# EAGLE schematic ABK-ECS - Rev A3 (EAGLE 7.7.0)

## Sheet 1 of 6: MCU
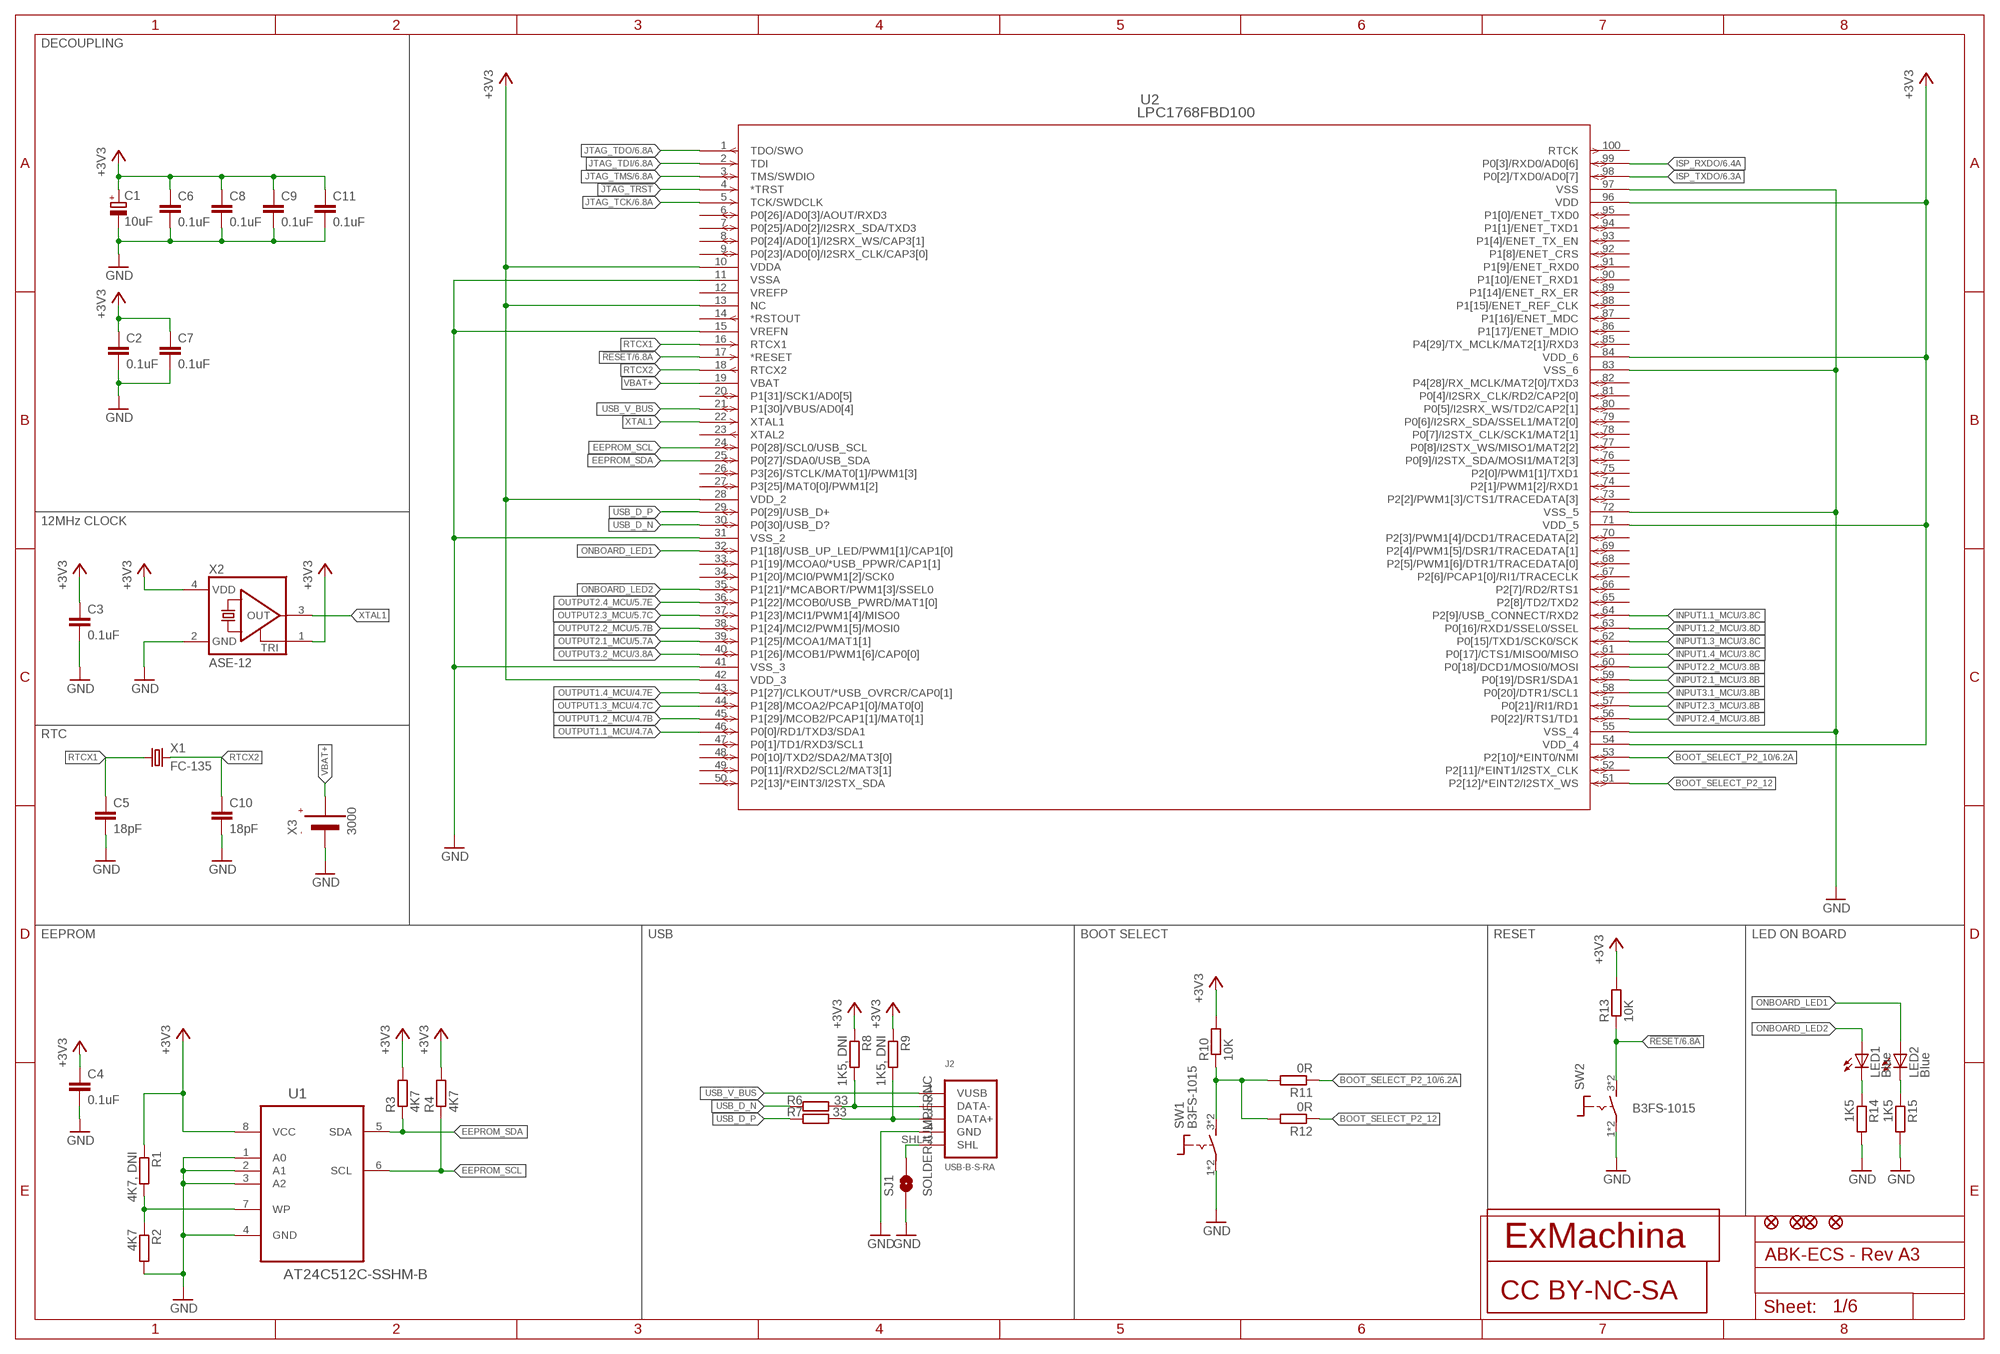
[diagram p0: schematic, sheet 1]

### Parts
C1  10uF  CPOL-EUCT3216  [CT3216]
C2  0.1uF  C-EUC0603  [C0603]
C3  0.1uF  C-EUC0603  [C0603]
C4  0.1uF  C-EUC0603  [C0603]
C5  18pF  C-EUC0603  [C0603]
C6  0.1uF  C-EUC0603  [C0603]
C7  0.1uF  C-EUC0603  [C0603]
C8  0.1uF  C-EUC0603  [C0603]
C9  0.1uF  C-EUC0603  [C0603]
C10  18pF  C-EUC0603  [C0603]
C11  0.1uF  C-EUC0603  [C0603]
CC1  CC-BY-NC-SA  [CC-BY-NC-SA]
J2  USB-B-S-RA  [USB-B-S-RA]
JP1  FIDUCIAL1X2  [FIDUCIAL-1X2]
JP2  FIDUCIAL1X2  [FIDUCIAL-1X2]
JP3  FIDUCIAL1X2  [FIDUCIAL-1X2]
JP4  FIDUCIAL1X2  [FIDUCIAL-1X2]
LED1  Blue  LEDCHIPLED_0603  [CHIPLED_0603]
LED2  Blue  LEDCHIPLED_0603  [CHIPLED_0603]
R1  4K7, DNI  R-EU_R0603  [R0603]
R2  4K7  R-EU_R0603  [R0603]
R3  4K7  R-EU_R0603  [R0603]
R4  4K7  R-EU_R0603  [R0603]
R6  33  R-EU_R0603  [R0603]
R7  33  R-EU_R0603  [R0603]
R8  1K5, DNI  R-EU_R0603  [R0603]
R9  1K5, DNI  R-EU_R0603  [R0603]
R10  10K  R-EU_R0603  [R0603]
R11  0R  R-EU_R0603  [R0603]
R12  0R  R-EU_R0603  [R0603]
R13  10K  R-EU_R0603  [R0603]
R14  1K5  R-EU_R0603  [R0603]
R15  1K5  R-EU_R0603  [R0603]
SJ1  SOLDERJUMPERNC  [SJ_2S]
SW1  B3FS-1015  [B3FS]
SW2  B3FS-1015  [B3FS]
T1  EXMACHINA-LOGO-NAME  [EXM-LOGO-BASELINE]
U1  AT24C512C-SSHM-B  [SOIC127P600X175-8N]
U2  LPC1768FBD100  [SOT407-1]
X1  FC-135  [FC-135]
X2  ASE-12  ASE  [ASE]
X3  3000  [3000]

### Nets
!JTAG_TRST: U2.4(*TRST)
!RESET: R13.1 SW2.3 SW2.4 U2.17(*RESET) ; also sheet 6
+3V3 [supply]: C1.+ C2.1 C3.1 C4.1 C6.1 C7.1 C8.1 C9.1 C11.1 R1.1 R3.2 R4.2 R8.1 R9.1 R10.2 R13.2 U1.8(VCC) U2.10(VDDA) U2.13(NC) U2.28(VDD_2) U2.42(VDD_3) U2.54(VDD_4) U2.71(VDD_5) U2.84(VDD_6) U2.96(VDD) X2.1(TRI) X2.4(VDD) ; also sheet 2,3,6
BOOT_SELECT_P2_10 [signal]: R11.1 U2.53(P2[10]/*EINT0/NMI) ; also sheet 6
BOOT_SELECT_P2_12 [signal]: R12.1 U2.51(P2[12]/*EINT2/I2STX_WS)
EEPROM_SCL: R4.1 U1.6(SCL) U2.24(P0[28]/SCL0/USB_SCL)
EEPROM_SDA: R3.1 U1.5(SDA) U2.25(P0[27]/SDA0/USB_SDA)
GND [supply]: C1.- C2.2 C3.2 C4.2 C5.2 C6.2 C7.2 C8.2 C9.2 C10.2 C11.2 J2.4(GND) R2.2 R14.2 R15.2 SJ1.1 SW1.1 SW1.2 SW2.1 SW2.2 U1.1(A0) U1.2(A1) U1.3(A2) U1.4(GND) U2.11(VSSA) U2.15(VREFN) U2.31(VSS_2) U2.41(VSS_3) U2.55(VSS_4) U2.72(VSS_5) U2.83(VSS_6) U2.97(VSS) X2.2(GND) X3.-(VBAT-) ; also sheet 2,3,4,5,6
INPUT1.1_MCU: U2.64(P2[9]/USB_CONNECT/RXD2) ; also sheet 3
INPUT1.2_MCU: U2.63(P0[16]/RXD1/SSEL0/SSEL) ; also sheet 3
INPUT1.3_MCU: U2.62(P0[15]/TXD1/SCK0/SCK) ; also sheet 3
INPUT1.4_MCU: U2.61(P0[17]/CTS1/MISO0/MISO) ; also sheet 3
INPUT2.1_MCU: U2.59(P0[19]/DSR1/SDA1) ; also sheet 3
INPUT2.2_MCU: U2.60(P0[18]/DCD1/MOSI0/MOSI) ; also sheet 3
INPUT2.3_MCU: U2.57(P0[21]/RI1/RD1) ; also sheet 3
INPUT2.4_MCU: U2.56(P0[22]/RTS1/TD1) ; also sheet 3
INPUT3.1_MCU: U2.58(P0[20]/DTR1/SCL1) ; also sheet 3
ISP_RXDO [signal]: U2.99(P0[3]/RXD0/AD0[6]) ; also sheet 6
ISP_TXDO [signal]: U2.98(P0[2]/TXD0/AD0[7]) ; also sheet 6
JTAG_TCK [signal]: U2.5(TCK/SWDCLK) ; also sheet 6
JTAG_TDI [signal]: U2.2(TDI) ; also sheet 6
JTAG_TDO [signal]: U2.1(TDO/SWO) ; also sheet 6
JTAG_TMS [signal]: U2.3(TMS/SWDIO) ; also sheet 6
N$1 [signal]: J2.3(DATA+) R7.1 R9.2
N$2 [signal]: J2.2(DATA-) R6.1 R8.2
N$3 [signal]: LED2.C R15.1
N$5 [signal]: R10.1 R11.2 R12.2 SW1.3 SW1.4
N$27: R1.2 R2.1 U1.7(WP)
N$29 [signal]: LED1.C R14.1
N$70: J2.SHL J2.SHL1(SHL) SJ1.2
ONBOARD_LED1 [signal]: LED2.A U2.32(P1[18]/USB_UP_LED/PWM1[1]/CAP1[0])
ONBOARD_LED2 [signal]: LED1.A U2.35(P1[21]/*MCABORT/PWM1[3]/SSEL0)
OUTPUT1.1_MCU: U2.46(P0[0]/RD1/TXD3/SDA1) ; also sheet 4
OUTPUT1.2_MCU: U2.45(P1[29]/MCOB2/PCAP1[1]/MAT0[1]) ; also sheet 4
OUTPUT1.3_MCU: U2.44(P1[28]/MCOA2/PCAP1[0]/MAT0[0]) ; also sheet 4
OUTPUT1.4_MCU: U2.43(P1[27]/CLKOUT/*USB_OVRCR/CAP0[1]) ; also sheet 4
OUTPUT2.1_MCU: U2.39(P1[25]/MCOA1/MAT1[1]) ; also sheet 5
OUTPUT2.2_MCU: U2.38(P1[24]/MCI2/PWM1[5]/MOSI0) ; also sheet 5
OUTPUT2.3_MCU: U2.37(P1[23]/MCI1/PWM1[4]/MISO0) ; also sheet 5
OUTPUT2.4_MCU: U2.36(P1[22]/MCOB0/USB_PWRD/MAT1[0]) ; also sheet 5
OUTPUT3.2_MCU: U2.40(P1[26]/MCOB1/PWM1[6]/CAP0[0]) ; also sheet 3,5
RTCX1: C5.1 U2.16(RTCX1) X1.1
RTCX2: C10.1 U2.18(RTCX2) X1.2
USB_D_N [signal]: R6.2 U2.30(P0[30]/USB_D?)
USB_D_P [signal]: R7.2 U2.29(P0[29]/USB_D+)
USB_V_BUS [signal]: J2.1(VUSB) U2.21(P1[30]/VBUS/AD0[4])
VBAT+: U2.19(VBAT) X3.+1(VBAT+) X3.+2(VBAT+)
XTAL1: U2.22(XTAL1) X2.3(OUT)
Unconnected: U2.6(P0[26]/AD0[3]/AOUT/RXD3) U2.7(P0[25]/AD0[2]/I2SRX_SDA/TXD3) U2.8(P0[24]/AD0[1]/I2SRX_WS/CAP3[1]) U2.9(P0[23]/AD0[0]/I2SRX_CLK/CAP3[0]) U2.14(*RSTOUT) U2.20(P1[31]/SCK1/AD0[5]) U2.23(XTAL2) U2.26(P3[26]/STCLK/MAT0[1]/PWM1[3]) U2.27(P3[25]/MAT0[0]/PWM1[2]) U2.33(P1[19]/MCOA0/*USB_PPWR/CAP1[1]) U2.34(P1[20]/MCI0/PWM1[2]/SCK0) U2.47(P0[1]/TD1/RXD3/SCL1) U2.48(P0[10]/TXD2/SDA2/MAT3[0]) U2.49(P0[11]/RXD2/SCL2/MAT3[1]) U2.50(P2[13]/*EINT3/I2STX_SDA) U2.52(P2[11]/*EINT1/I2STX_CLK) U2.65(P2[8]/TD2/TXD2) U2.66(P2[7]/RD2/RTS1) U2.67(P2[6]/PCAP1[0]/RI1/TRACECLK) U2.68(P2[5]/PWM1[6]/DTR1/TRACEDATA[0]) U2.69(P2[4]/PWM1[5]/DSR1/TRACEDATA[1]) U2.70(P2[3]/PWM1[4]/DCD1/TRACEDATA[2]) U2.73(P2[2]/PWM1[3]/CTS1/TRACEDATA[3]) U2.74(P2[1]/PWM1[2]/RXD1) U2.75(P2[0]/PWM1[1]/TXD1) U2.76(P0[9]/I2STX_SDA/MOSI1/MAT2[3]) U2.77(P0[8]/I2STX_WS/MISO1/MAT2[2]) U2.78(P0[7]/I2STX_CLK/SCK1/MAT2[1]) U2.79(P0[6]/I2SRX_SDA/SSEL1/MAT2[0]) U2.80(P0[5]/I2SRX_WS/TD2/CAP2[1]) U2.81(P0[4]/I2SRX_CLK/RD2/CAP2[0]) U2.82(P4[28]/RX_MCLK/MAT2[0]/TXD3) U2.85(P4[29]/TX_MCLK/MAT2[1]/RXD3) U2.86(P1[17]/ENET_MDIO) U2.87(P1[16]/ENET_MDC) U2.88(P1[15]/ENET_REF_CLK) U2.89(P1[14]/ENET_RX_ER) U2.90(P1[10]/ENET_RXD1) U2.91(P1[9]/ENET_RXD0) U2.92(P1[8]/ENET_CRS) U2.93(P1[4]/ENET_TX_EN) U2.94(P1[1]/ENET_TXD1) U2.95(P1[0]/ENET_TXD0) U2.100(RTCK)

### Notes on the sheet
- DECOUPLING
- 12MHz CLOCK
- RTC
- EEPROM | USB | BOOT SELECT | RESET | LED ON BOARD

## Sheet 2 of 6: POWER
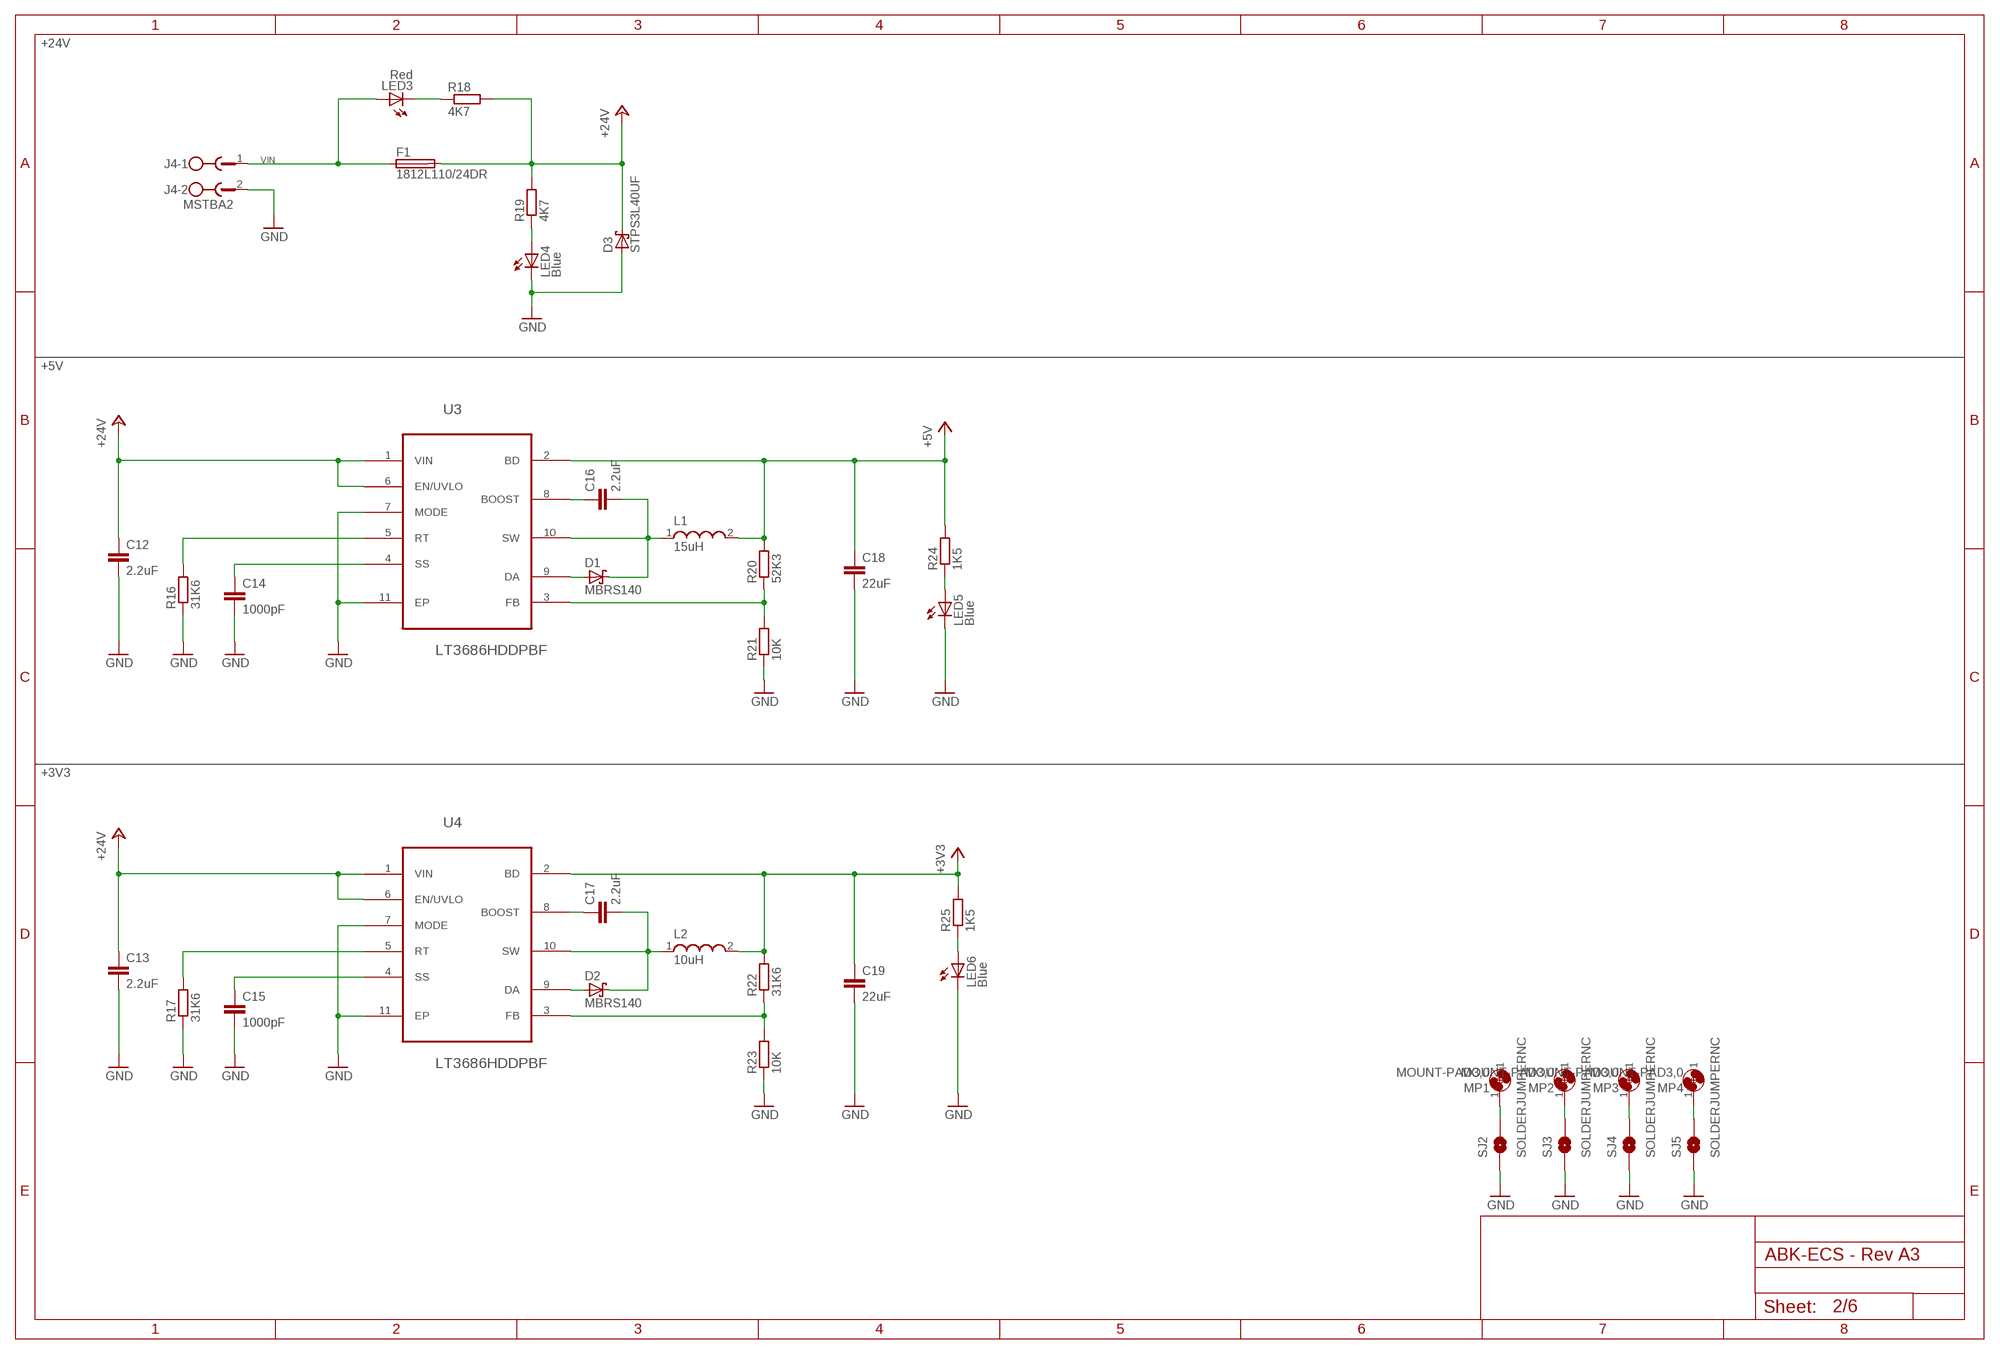
[diagram p1: schematic, sheet 2]

### Parts
C12  2.2uF  C-EUC0603  [C0603]
C13  2.2uF  C-EUC0603  [C0603]
C14  1000pF  C-EUC0603  [C0603]
C15  1000pF  C-EUC0603  [C0603]
C16  2.2uF  C-EUC0603  [C0603]
C17  2.2uF  C-EUC0603  [C0603]
C18  22uF  C-EUC0805  [C0805]
C19  22uF  C-EUC0805  [C0805]
D1  MBRS140  [DO-214AA]
D2  MBRS140  [DO-214AA]
D3  STPS3L40UF  [SMB]
F1  1812L110/24DR  [LITTLEFUSE_SMD]
J4  MSTBA2  [MSTBA2]
L1  15uH  WE-PD2_5848/5820  [WE-PD2_5848/5820]
L2  10uH  WE-PD2_5848/5820  [WE-PD2_5848/5820]
LED3  Red  LEDCHIPLED_0603  [CHIPLED_0603]
LED4  Blue  LEDCHIPLED_0603  [CHIPLED_0603]
LED5  Blue  LEDCHIPLED_0603  [CHIPLED_0603]
LED6  Blue  LEDCHIPLED_0603  [CHIPLED_0603]
MP1  MOUNT-PAD3,0  [P3,0]
MP2  MOUNT-PAD3,0  [P3,0]
MP3  MOUNT-PAD3,0  [P3,0]
MP4  MOUNT-PAD3,0  [P3,0]
R16  31K6  R-EU_R0603  [R0603]
R17  31K6  R-EU_R0603  [R0603]
R18  4K7  R-EU_R0603  [R0603]
R19  4K7  R-EU_R0603  [R0603]
R20  52K3  R-EU_R0603  [R0603]
R21  10K  R-EU_R0603  [R0603]
R22  31K6  R-EU_R0603  [R0603]
R23  10K  R-EU_R0603  [R0603]
R24  1K5  R-EU_R0603  [R0603]
R25  1K5  R-EU_R0603  [R0603]
SJ2  SOLDERJUMPERNC  [SJ_2S]
SJ3  SOLDERJUMPERNC  [SJ_2S]
SJ4  SOLDERJUMPERNC  [SJ_2S]
SJ5  SOLDERJUMPERNC  [SJ_2S]
U3  LT3686HDDPBF  [DFN300X300X80-11N]
U4  LT3686HDDPBF  [DFN300X300X80-11N]

### Nets
1: MP1.1 SJ2.2
2: MP2.1 SJ3.2
3: MP3.1 SJ4.2
4: MP4.1 SJ5.2
+3V3 [supply]: C19.1 L2.2 R22.2 R25.2 U4.2(BD) ; also sheet 1,3,6
+5V [supply]: C18.1 L1.2 R20.2 R24.2 U3.2(BD) ; also sheet 3,4,5
+24V: C12.1 C13.1 D3.C F1.2 R18.2 R19.2 U3.1(VIN) U3.6(EN/UVLO) U4.1(VIN) U4.6(EN/UVLO) ; also sheet 3,4,5
GND [supply]: C12.2 C13.2 C14.2 C15.2 C18.2 C19.2 D3.A J4.2 LED4.C LED5.C LED6.C R16.1 R17.1 R21.1 R23.1 SJ2.1 SJ3.1 SJ4.1 SJ5.1 U3.7(MODE) U3.11(EP) U4.7(MODE) U4.11(EP) ; also sheet 1,3,4,5,6
N$4: R16.2 U3.5(RT)
N$6: C14.1 U3.4(SS)
N$7: R17.2 U4.5(RT)
N$8: C15.1 U4.4(SS)
N$9: R20.1 R21.2 U3.3(FB)
N$10: C16.1 U3.8(BOOST)
N$11: C16.2 D1.C L1.1 U3.10(SW)
N$12: D1.A U3.9(DA)
N$13: R22.1 R23.2 U4.3(FB)
N$14: C17.1 U4.8(BOOST)
N$15: C17.2 D2.C L2.1 U4.10(SW)
N$16: D2.A U4.9(DA)
N$44: LED4.A R19.1
N$45: LED3.C R18.1
N$50: LED6.A R25.1
N$51: LED5.A R24.1
VIN: F1.1 J4.1 LED3.A

### Notes on the sheet
- +24V
- +5V
- +3V3

## Sheet 3 of 6: INPUT
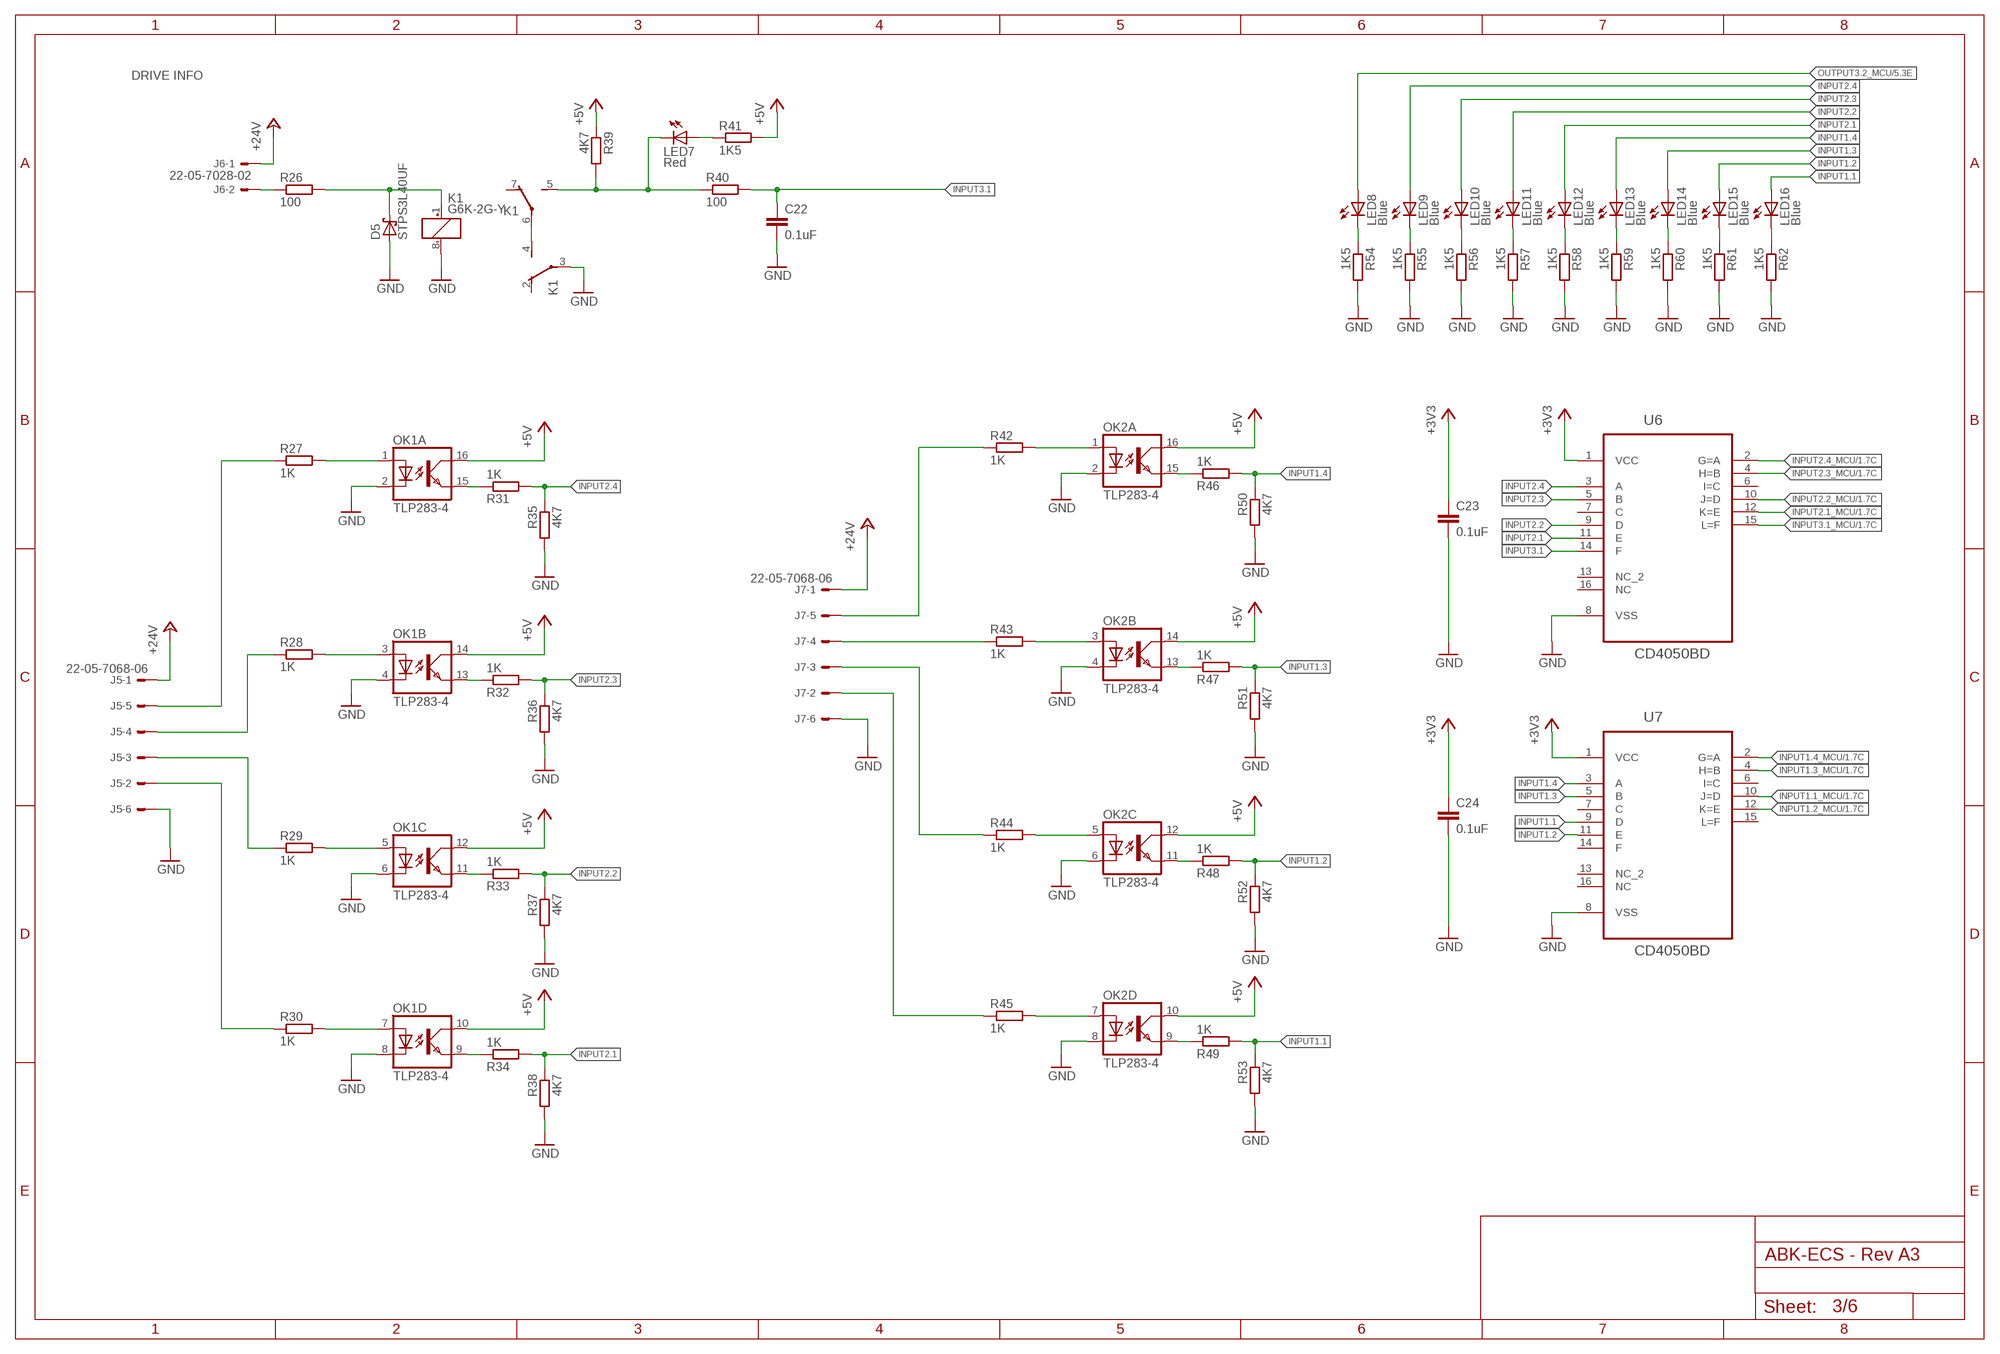
[diagram p2: schematic, sheet 3]

### Parts
C22  0.1uF  C-EUC0603  [C0603]
C23  0.1uF  C-EUC0603  [C0603]
C24  0.1uF  C-EUC0603  [C0603]
D5  STPS3L40UF  [SMB]
J5  22-05-7068-06  [7395-06]
J6  22-05-7028-02  [7395-02]
J7  22-05-7068-06  [7395-06]
K1  G6K-2G-Y  [G6K-2G-Y]
LED7  Red  LEDCHIPLED_0603  [CHIPLED_0603]
LED8  Blue  LEDCHIPLED_0603  [CHIPLED_0603]
LED9  Blue  LEDCHIPLED_0603  [CHIPLED_0603]
LED10  Blue  LEDCHIPLED_0603  [CHIPLED_0603]
LED11  Blue  LEDCHIPLED_0603  [CHIPLED_0603]
LED12  Blue  LEDCHIPLED_0603  [CHIPLED_0603]
LED13  Blue  LEDCHIPLED_0603  [CHIPLED_0603]
LED14  Blue  LEDCHIPLED_0603  [CHIPLED_0603]
LED15  Blue  LEDCHIPLED_0603  [CHIPLED_0603]
LED16  Blue  LEDCHIPLED_0603  [CHIPLED_0603]
OK1  TLP283-4  [MINI-FLAT-16]
OK2  TLP283-4  [MINI-FLAT-16]
R26  100  R-EU_R0603  [R0603]
R27  1K  R-EU_R0603  [R0603]
R28  1K  R-EU_R0603  [R0603]
R29  1K  R-EU_R0603  [R0603]
R30  1K  R-EU_R0603  [R0603]
R31  1K  R-EU_R0603  [R0603]
R32  1K  R-EU_R0603  [R0603]
R33  1K  R-EU_R0603  [R0603]
R34  1K  R-EU_R0603  [R0603]
R35  4K7  R-EU_R0603  [R0603]
R36  4K7  R-EU_R0603  [R0603]
R37  4K7  R-EU_R0603  [R0603]
R38  4K7  R-EU_R0603  [R0603]
R39  4K7  R-EU_R0603  [R0603]
R40  100  R-EU_R0603  [R0603]
R41  1K5  R-EU_R0603  [R0603]
R42  1K  R-EU_R0603  [R0603]
R43  1K  R-EU_R0603  [R0603]
R44  1K  R-EU_R0603  [R0603]
R45  1K  R-EU_R0603  [R0603]
R46  1K  R-EU_R0603  [R0603]
R47  1K  R-EU_R0603  [R0603]
R48  1K  R-EU_R0603  [R0603]
R49  1K  R-EU_R0603  [R0603]
R50  4K7  R-EU_R0603  [R0603]
R51  4K7  R-EU_R0603  [R0603]
R52  4K7  R-EU_R0603  [R0603]
R53  4K7  R-EU_R0603  [R0603]
R54  1K5  R-EU_R0603  [R0603]
R55  1K5  R-EU_R0603  [R0603]
R56  1K5  R-EU_R0603  [R0603]
R57  1K5  R-EU_R0603  [R0603]
R58  1K5  R-EU_R0603  [R0603]
R59  1K5  R-EU_R0603  [R0603]
R60  1K5  R-EU_R0603  [R0603]
R61  1K5  R-EU_R0603  [R0603]
R62  1K5  R-EU_R0603  [R0603]
U6  CD4050BD  [SOIC127P600X175-16N]
U7  CD4050BD  [SOIC127P600X175-16N]

### Nets
+3V3 [supply]: C23.1 C24.1 U6.1(VCC) U7.1(VCC) ; also sheet 1,2,6
+5V [supply]: OK1.10(D:COL) OK1.12(C:COL) OK1.14(B:COL) OK1.16(A:COL) OK2.10(D:COL) OK2.12(C:COL) OK2.14(B:COL) OK2.16(A:COL) R39.1 R41.2 ; also sheet 2,4,5
+24V: J5.1 J6.1 J7.1 ; also sheet 2,4,5
GND [supply]: C22.2 C23.2 C24.2 D5.A J5.6 J7.6 K1.3(2:P) K1.8(1:-) OK1.2(A:C) OK1.4(B:C) OK1.6(C:C) OK1.8(D:C) OK2.2(A:C) OK2.4(B:C) OK2.6(C:C) OK2.8(D:C) R35.2 R36.2 R37.2 R38.2 R50.2 R51.2 R52.2 R53.2 R54.2 R55.2 R56.2 R57.2 R58.2 R59.2 R60.2 R61.2 R62.2 U6.8(VSS) U7.8(VSS) ; also sheet 1,2,4,5,6
INPUT1.1: LED16.A R49.2 R53.1 U7.9(D)
INPUT1.1_MCU: U7.10(J=D) ; also sheet 1
INPUT1.2: LED15.A R48.2 R52.1 U7.11(E)
INPUT1.2_MCU: U7.12(K=E) ; also sheet 1
INPUT1.3: LED14.A R47.2 R51.1 U7.5(B)
INPUT1.3_MCU: U7.4(H=B) ; also sheet 1
INPUT1.4: LED13.A R46.2 R50.1 U7.3(A)
INPUT1.4_MCU: U7.2(G=A) ; also sheet 1
INPUT2.1: LED12.A R34.2 R38.1 U6.11(E)
INPUT2.1_MCU: U6.12(K=E) ; also sheet 1
INPUT2.2: LED11.A R33.2 R37.1 U6.9(D)
INPUT2.2_MCU: U6.10(J=D) ; also sheet 1
INPUT2.3: LED10.A R32.2 R36.1 U6.5(B)
INPUT2.3_MCU: U6.4(H=B) ; also sheet 1
INPUT2.4: LED9.A R31.2 R35.1 U6.3(A)
INPUT2.4_MCU: U6.2(G=A) ; also sheet 1
INPUT3.1: C22.1 R40.2 U6.14(F)
INPUT3.1_MCU: U6.15(L=F) ; also sheet 1
N$28: D5.C K1.1(1:+) R26.2
N$32: J6.2 R26.1
N$41: OK1.1(A:A) R27.2
N$47: OK1.3(B:A) R28.2
N$48: OK1.5(C:A) R29.2
N$49: OK1.7(D:A) R30.2
N$52: J5.2 R30.1
N$53: J5.3 R29.1
N$54: J5.4 R28.1
N$55: J5.5 R27.1
N$56 [signal]: LED8.C R54.1
N$57 [signal]: LED9.C R55.1
N$58 [signal]: LED10.C R56.1
N$59 [signal]: LED11.C R57.1
N$60: K1.4(2:S) K1.6(3:P)
N$61: OK1.9(D:EMIT) R34.1
N$62: OK1.11(C:EMIT) R33.1
N$63: OK1.13(B:EMIT) R32.1
N$64: OK1.15(A:EMIT) R31.1
N$65 [signal]: LED12.C R58.1
N$73: K1.5(3:S) LED7.C R39.2 R40.1
N$74: LED7.A R41.1
N$81: OK2.1(A:A) R42.2
N$82: J7.5 R42.1
N$90 [signal]: LED16.C R62.1
N$100: OK2.15(A:EMIT) R46.1
N$101: OK2.3(B:A) R43.2
N$102: J7.4 R43.1
N$103: OK2.13(B:EMIT) R47.1
N$104: OK2.5(C:A) R44.2
N$105: J7.3 R44.1
N$106: OK2.11(C:EMIT) R48.1
N$107 [signal]: LED13.C R59.1
N$108 [signal]: LED14.C R60.1
N$109 [signal]: LED15.C R61.1
N$110: OK2.9(D:EMIT) R49.1
N$111: OK2.7(D:A) R45.2
N$112: J7.2 R45.1
OUTPUT3.2_MCU: LED8.A ; also sheet 1,5
Unconnected: K1.2(2:O) K1.7(3:O) U6.6(I=C) U6.7(C) U6.13(NC_2) U6.16(NC) U7.6(I=C) U7.7(C) U7.13(NC_2) U7.14(F) U7.15(L=F) U7.16(NC)

### Notes on the sheet
- DRIVE INFO

## Sheet 4 of 6: OUTPUT 1/2
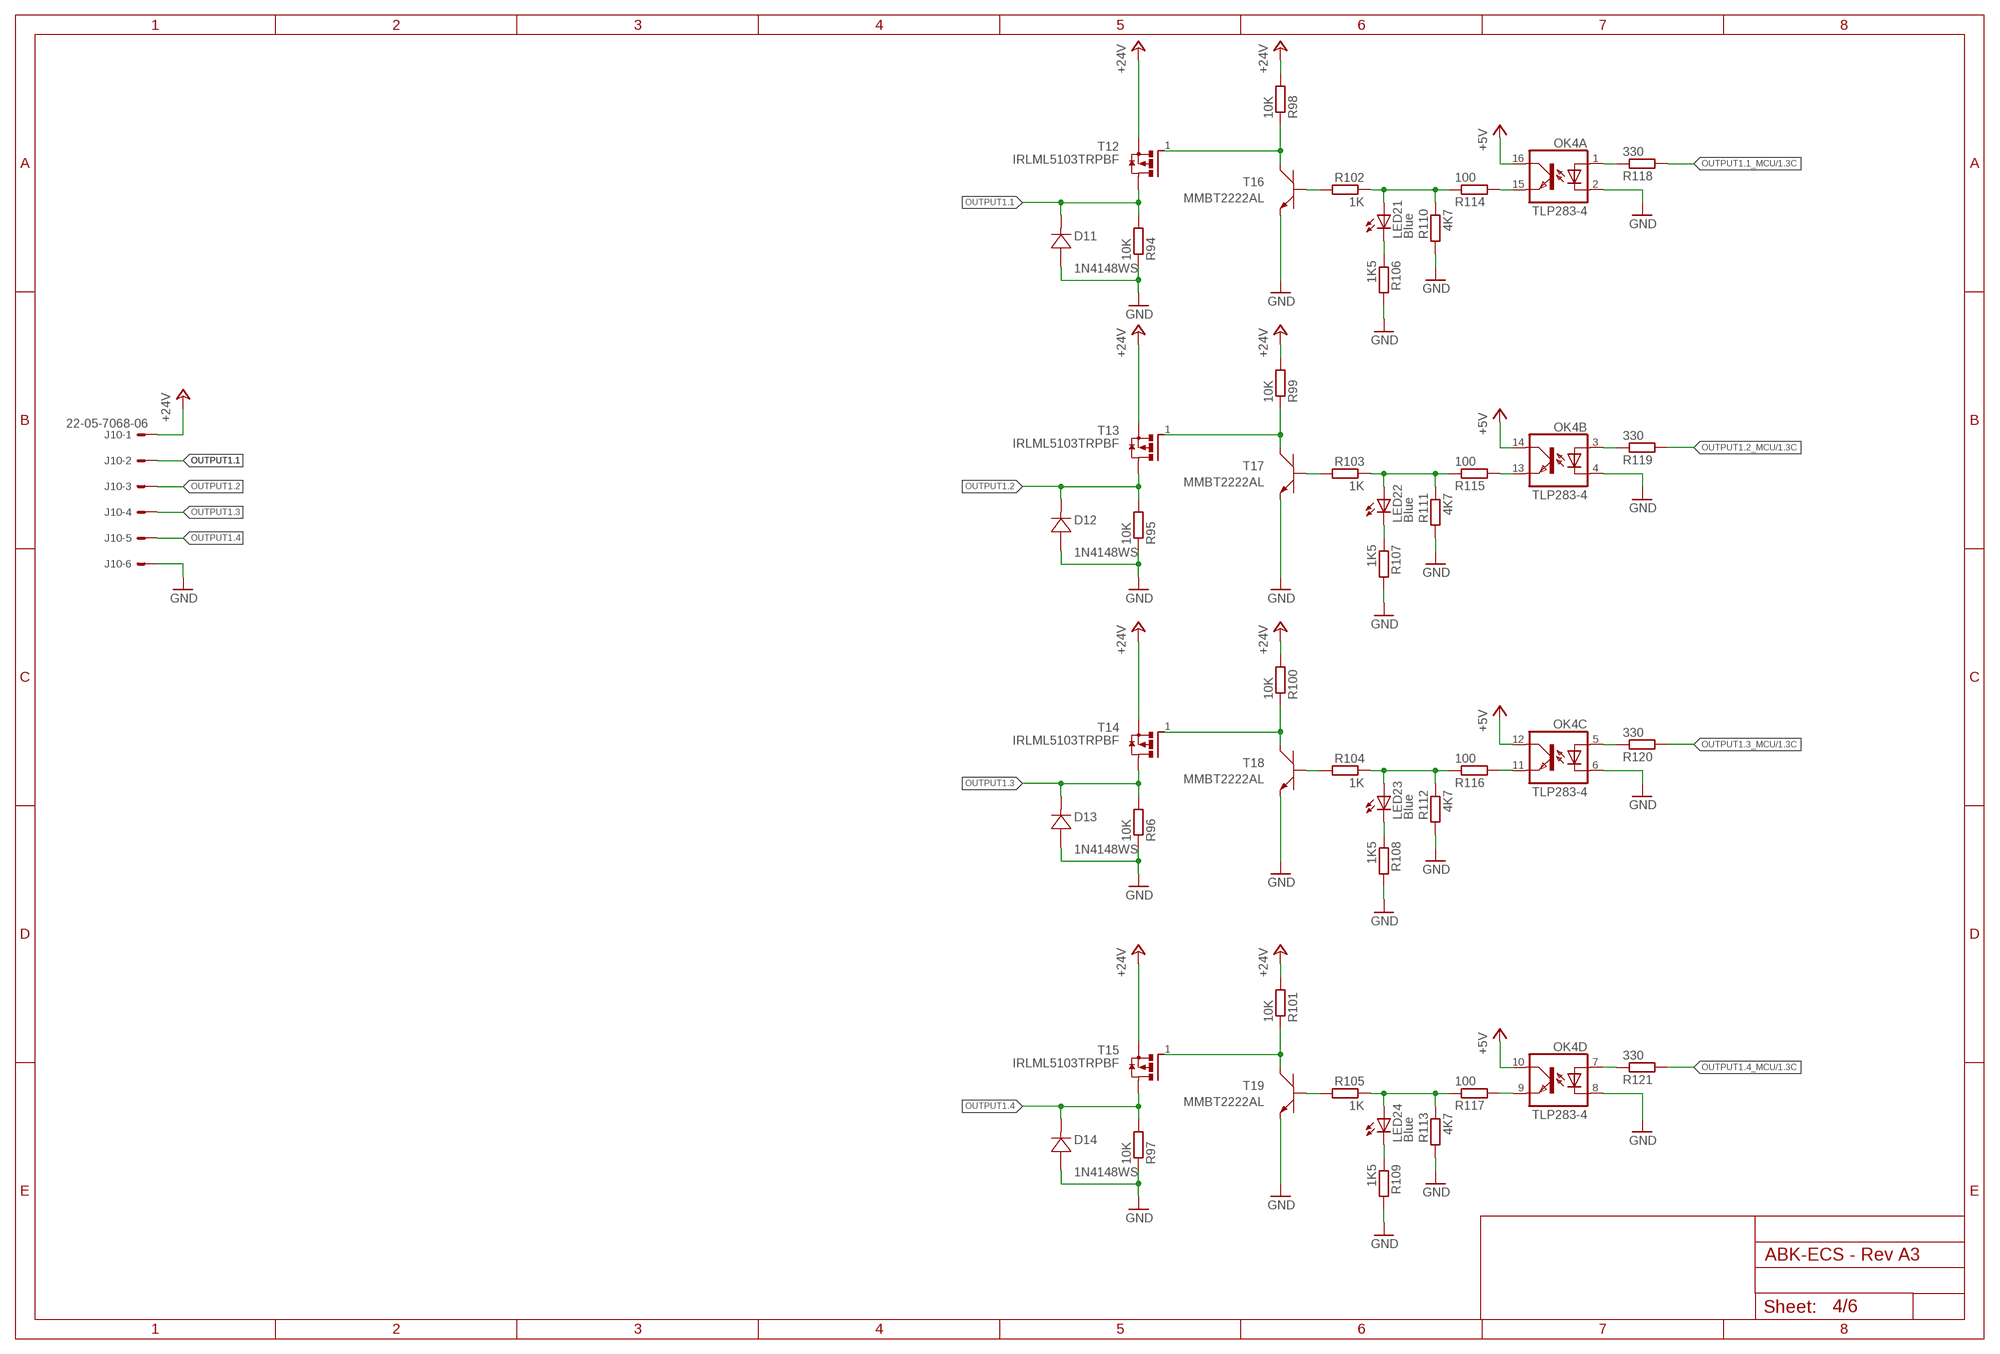
[diagram p3: schematic, sheet 4]

### Parts
D11  1N4148WS  [SOD323-W]
D12  1N4148WS  [SOD323-W]
D13  1N4148WS  [SOD323-W]
D14  1N4148WS  [SOD323-W]
J10  22-05-7068-06  [7395-06]
LED21  Blue  LEDCHIPLED_0603  [CHIPLED_0603]
LED22  Blue  LEDCHIPLED_0603  [CHIPLED_0603]
LED23  Blue  LEDCHIPLED_0603  [CHIPLED_0603]
LED24  Blue  LEDCHIPLED_0603  [CHIPLED_0603]
OK4  TLP283-4  [MINI-FLAT-16]
R94  10K  R-EU_R0603  [R0603]
R95  10K  R-EU_R0603  [R0603]
R96  10K  R-EU_R0603  [R0603]
R97  10K  R-EU_R0603  [R0603]
R98  10K  R-EU_R0603  [R0603]
R99  10K  R-EU_R0603  [R0603]
R100  10K  R-EU_R0603  [R0603]
R101  10K  R-EU_R0603  [R0603]
R102  1K  R-EU_R0603  [R0603]
R103  1K  R-EU_R0603  [R0603]
R104  1K  R-EU_R0603  [R0603]
R105  1K  R-EU_R0603  [R0603]
R106  1K5  R-EU_R0603  [R0603]
R107  1K5  R-EU_R0603  [R0603]
R108  1K5  R-EU_R0603  [R0603]
R109  1K5  R-EU_R0603  [R0603]
R110  4K7  R-EU_R0603  [R0603]
R111  4K7  R-EU_R0603  [R0603]
R112  4K7  R-EU_R0603  [R0603]
R113  4K7  R-EU_R0603  [R0603]
R114  100  R-EU_R0603  [R0603]
R115  100  R-EU_R0603  [R0603]
R116  100  R-EU_R0603  [R0603]
R117  100  R-EU_R0603  [R0603]
R118  330  R-EU_R0603  [R0603]
R119  330  R-EU_R0603  [R0603]
R120  330  R-EU_R0603  [R0603]
R121  330  R-EU_R0603  [R0603]
T12  IRLML5103TRPBF  [SOT95P240X112-3N]
T13  IRLML5103TRPBF  [SOT95P240X112-3N]
T14  IRLML5103TRPBF  [SOT95P240X112-3N]
T15  IRLML5103TRPBF  [SOT95P240X112-3N]
T16  MMBT2222AL  [SOT−23]
T17  MMBT2222AL  [SOT−23]
T18  MMBT2222AL  [SOT−23]
T19  MMBT2222AL  [SOT−23]

### Nets
+5V [supply]: OK4.10(D:COL) OK4.12(C:COL) OK4.14(B:COL) OK4.16(A:COL) ; also sheet 2,3,5
+24V: J10.1 R98.2 R99.2 R100.2 R101.2 T12.2(S) T13.2(S) T14.2(S) T15.2(S) ; also sheet 2,3,5
GND [supply]: D11.A D12.A D13.A D14.A J10.6 OK4.2(A:C) OK4.4(B:C) OK4.6(C:C) OK4.8(D:C) R94.1 R95.1 R96.1 R97.1 R106.2 R107.2 R108.2 R109.2 R110.2 R111.2 R112.2 R113.2 T16.2(E) T17.2(E) T18.2(E) T19.2(E) ; also sheet 1,2,3,5,6
N$31: LED21.A R102.1 R110.1 R114.1
N$33: OK4.15(A:EMIT) R114.2
N$34: LED22.A R103.1 R111.1 R115.1
N$35: OK4.13(B:EMIT) R115.2
N$36: LED23.A R104.1 R112.1 R116.1
N$37: LED24.A R105.1 R113.1 R117.1
N$38: OK4.11(C:EMIT) R116.2
N$39: OK4.9(D:EMIT) R117.2
N$40: OK4.1(A:A) R118.1
N$42: OK4.3(B:A) R119.1
N$43: OK4.7(D:A) R121.1
N$46: OK4.5(C:A) R120.1
N$66 [signal]: LED21.C R106.1
N$67 [signal]: LED22.C R107.1
N$68 [signal]: LED23.C R108.1
N$69 [signal]: LED24.C R109.1
N$71: R98.1 T12.1(G) T16.3(C)
N$72: R99.1 T13.1(G) T17.3(C)
N$77: R100.1 T14.1(G) T18.3(C)
N$78: R101.1 T15.1(G) T19.3(C)
N$84: R102.2 T16.1(B)
N$85: R103.2 T17.1(B)
N$98: R104.2 T18.1(B)
N$99: R105.2 T19.1(B)
OUTPUT1.1: D11.C J10.2 R94.2 T12.3(D)
OUTPUT1.1_MCU: R118.2 ; also sheet 1
OUTPUT1.2: D12.C J10.3 R95.2 T13.3(D)
OUTPUT1.2_MCU: R119.2 ; also sheet 1
OUTPUT1.3: D13.C J10.4 R96.2 T14.3(D)
OUTPUT1.3_MCU: R120.2 ; also sheet 1
OUTPUT1.4: D14.C J10.5 R97.2 T15.3(D)
OUTPUT1.4_MCU: R121.2 ; also sheet 1

## Sheet 5 of 6: OUTPUT 2/2
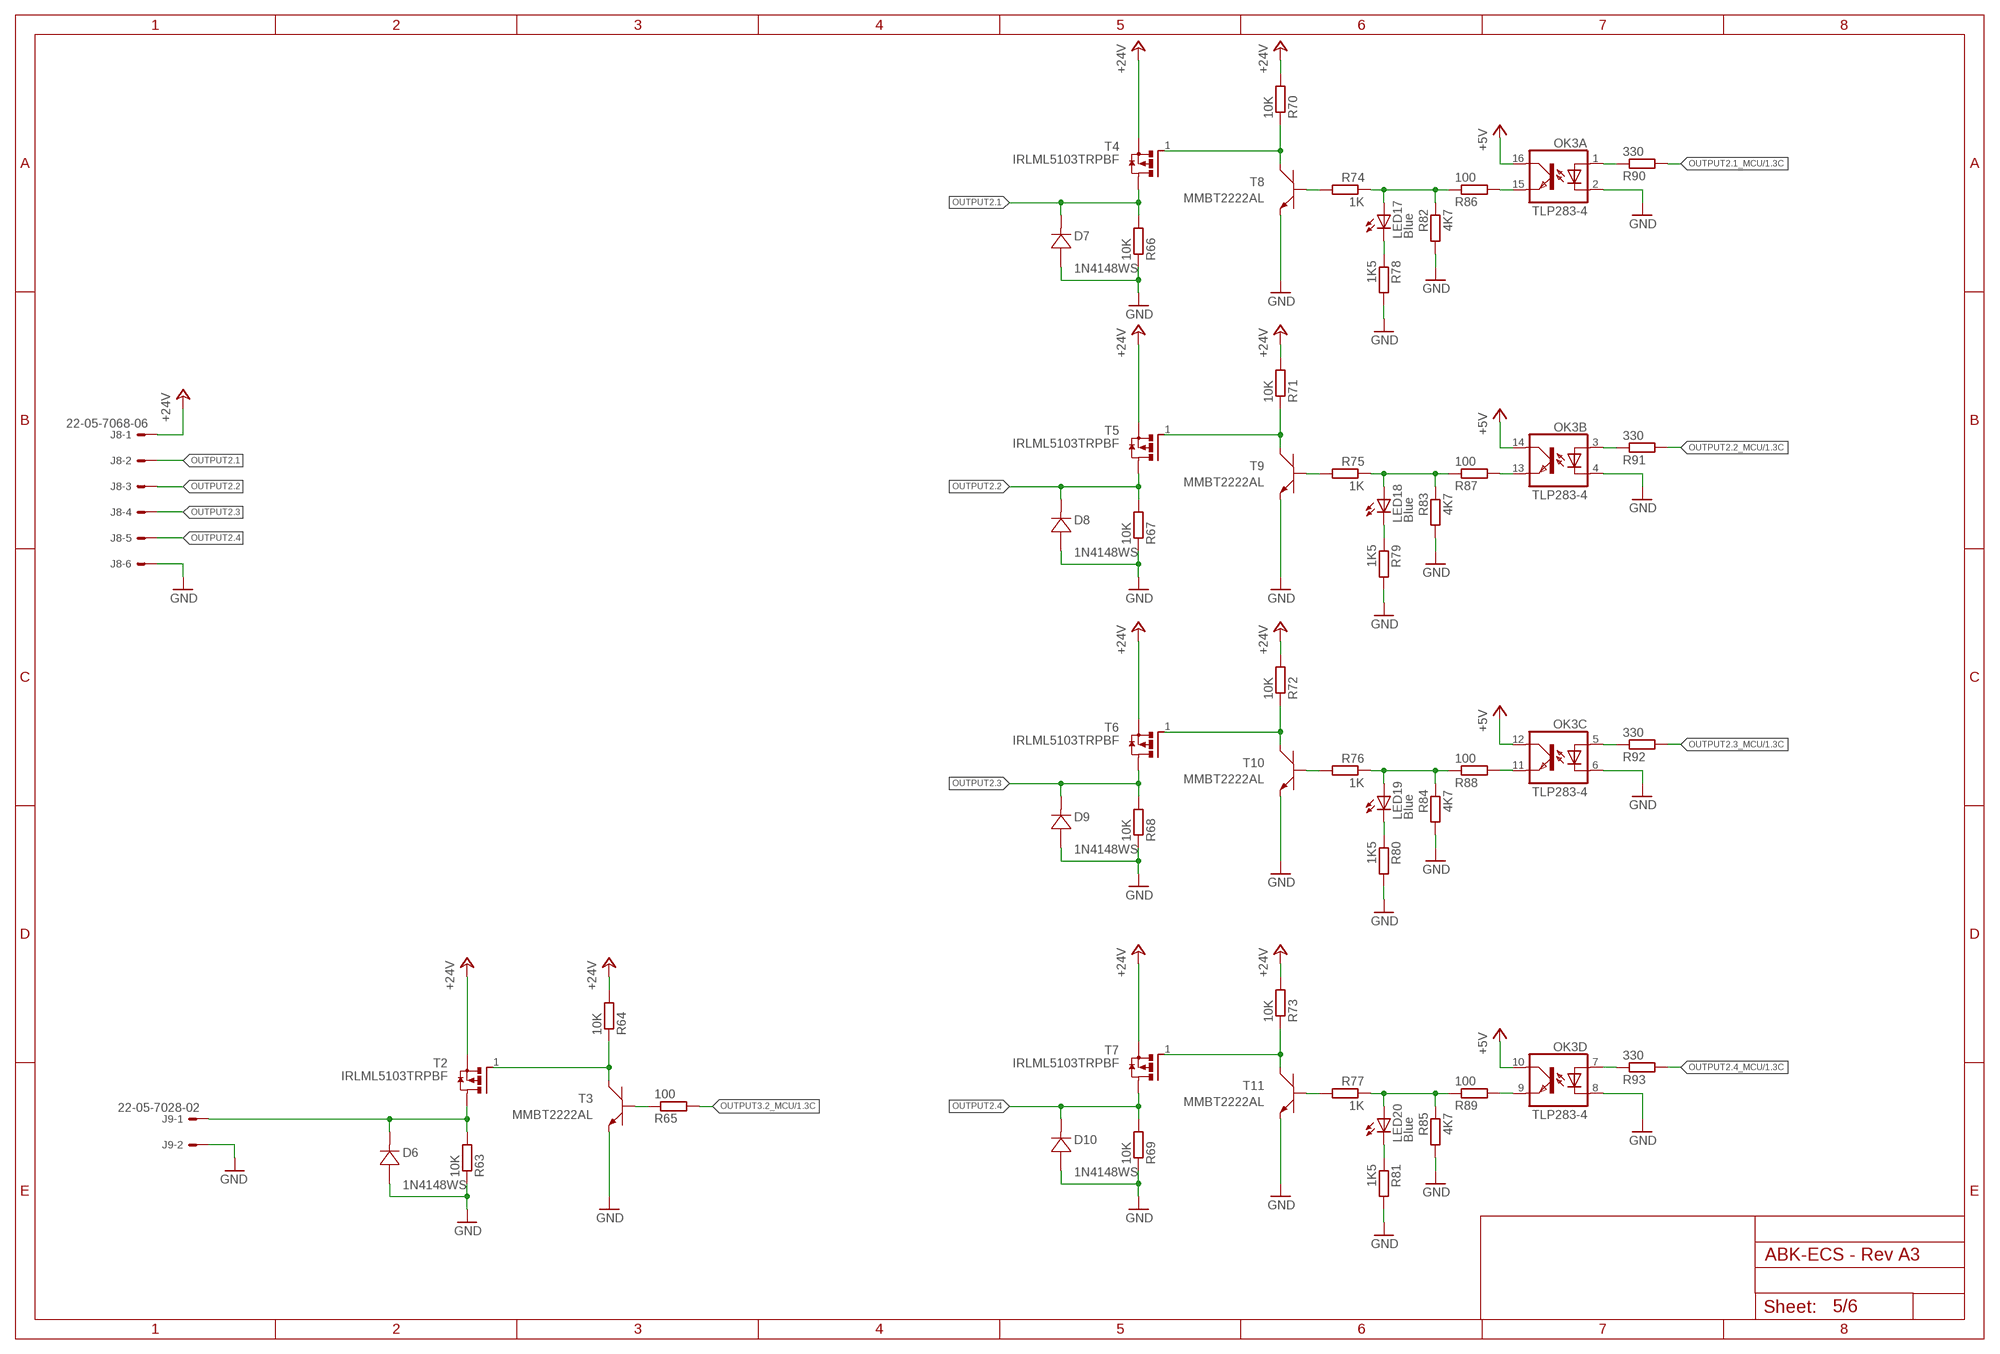
[diagram p4: schematic, sheet 5]

### Parts
D6  1N4148WS  [SOD323-W]
D7  1N4148WS  [SOD323-W]
D8  1N4148WS  [SOD323-W]
D9  1N4148WS  [SOD323-W]
D10  1N4148WS  [SOD323-W]
J8  22-05-7068-06  [7395-06]
J9  22-05-7028-02  [7395-02]
LED17  Blue  LEDCHIPLED_0603  [CHIPLED_0603]
LED18  Blue  LEDCHIPLED_0603  [CHIPLED_0603]
LED19  Blue  LEDCHIPLED_0603  [CHIPLED_0603]
LED20  Blue  LEDCHIPLED_0603  [CHIPLED_0603]
OK3  TLP283-4  [MINI-FLAT-16]
R63  10K  R-EU_R0603  [R0603]
R64  10K  R-EU_R0603  [R0603]
R65  100  R-EU_R0603  [R0603]
R66  10K  R-EU_R0603  [R0603]
R67  10K  R-EU_R0603  [R0603]
R68  10K  R-EU_R0603  [R0603]
R69  10K  R-EU_R0603  [R0603]
R70  10K  R-EU_R0603  [R0603]
R71  10K  R-EU_R0603  [R0603]
R72  10K  R-EU_R0603  [R0603]
R73  10K  R-EU_R0603  [R0603]
R74  1K  R-EU_R0603  [R0603]
R75  1K  R-EU_R0603  [R0603]
R76  1K  R-EU_R0603  [R0603]
R77  1K  R-EU_R0603  [R0603]
R78  1K5  R-EU_R0603  [R0603]
R79  1K5  R-EU_R0603  [R0603]
R80  1K5  R-EU_R0603  [R0603]
R81  1K5  R-EU_R0603  [R0603]
R82  4K7  R-EU_R0603  [R0603]
R83  4K7  R-EU_R0603  [R0603]
R84  4K7  R-EU_R0603  [R0603]
R85  4K7  R-EU_R0603  [R0603]
R86  100  R-EU_R0603  [R0603]
R87  100  R-EU_R0603  [R0603]
R88  100  R-EU_R0603  [R0603]
R89  100  R-EU_R0603  [R0603]
R90  330  R-EU_R0603  [R0603]
R91  330  R-EU_R0603  [R0603]
R92  330  R-EU_R0603  [R0603]
R93  330  R-EU_R0603  [R0603]
T2  IRLML5103TRPBF  [SOT95P240X112-3N]
T3  MMBT2222AL  [SOT−23]
T4  IRLML5103TRPBF  [SOT95P240X112-3N]
T5  IRLML5103TRPBF  [SOT95P240X112-3N]
T6  IRLML5103TRPBF  [SOT95P240X112-3N]
T7  IRLML5103TRPBF  [SOT95P240X112-3N]
T8  MMBT2222AL  [SOT−23]
T9  MMBT2222AL  [SOT−23]
T10  MMBT2222AL  [SOT−23]
T11  MMBT2222AL  [SOT−23]

### Nets
+5V [supply]: OK3.10(D:COL) OK3.12(C:COL) OK3.14(B:COL) OK3.16(A:COL) ; also sheet 2,3,4
+24V: J8.1 R64.2 R70.2 R71.2 R72.2 R73.2 T2.2(S) T4.2(S) T5.2(S) T6.2(S) T7.2(S) ; also sheet 2,3,4
GND [supply]: D6.A D7.A D8.A D9.A D10.A J8.6 J9.2 OK3.2(A:C) OK3.4(B:C) OK3.6(C:C) OK3.8(D:C) R63.1 R66.1 R67.1 R68.1 R69.1 R78.2 R79.2 R80.2 R81.2 R82.2 R83.2 R84.2 R85.2 T3.2(E) T8.2(E) T9.2(E) T10.2(E) T11.2(E) ; also sheet 1,2,3,4,6
MOTOR_VFQ: D6.C J9.1 R63.2 T2.3(D)
N$17: R74.2 T8.1(B)
N$18: R70.1 T4.1(G) T8.3(C)
N$19: R75.2 T9.1(B)
N$20: R71.1 T5.1(G) T9.3(C)
N$21: R76.2 T10.1(B)
N$22: R72.1 T6.1(G) T10.3(C)
N$23: R77.2 T11.1(B)
N$24: R73.1 T7.1(G) T11.3(C)
N$25: R65.1 T3.1(B)
N$26: R64.1 T2.1(G) T3.3(C)
N$75: LED17.A R74.1 R82.1 R86.1
N$76: OK3.15(A:EMIT) R86.2
N$79: LED18.A R75.1 R83.1 R87.1
N$80: OK3.13(B:EMIT) R87.2
N$83: LED19.A R76.1 R84.1 R88.1
N$86: LED20.A R77.1 R85.1 R89.1
N$87: OK3.11(C:EMIT) R88.2
N$88: OK3.9(D:EMIT) R89.2
N$89: OK3.1(A:A) R90.1
N$91: OK3.3(B:A) R91.1
N$92: OK3.7(D:A) R93.1
N$93: OK3.5(C:A) R92.1
N$94 [signal]: LED17.C R78.1
N$95 [signal]: LED18.C R79.1
N$96 [signal]: LED19.C R80.1
N$97 [signal]: LED20.C R81.1
OUTPUT2.1: D7.C J8.2 R66.2 T4.3(D)
OUTPUT2.1_MCU: R90.2 ; also sheet 1
OUTPUT2.2: D8.C J8.3 R67.2 T5.3(D)
OUTPUT2.2_MCU: R91.2 ; also sheet 1
OUTPUT2.3: D9.C J8.4 R68.2 T6.3(D)
OUTPUT2.3_MCU: R92.2 ; also sheet 1
OUTPUT2.4: D10.C J8.5 R69.2 T7.3(D)
OUTPUT2.4_MCU: R93.2 ; also sheet 1
OUTPUT3.2_MCU: R65.2 ; also sheet 1,3

## Sheet 6 of 6: Programming interface
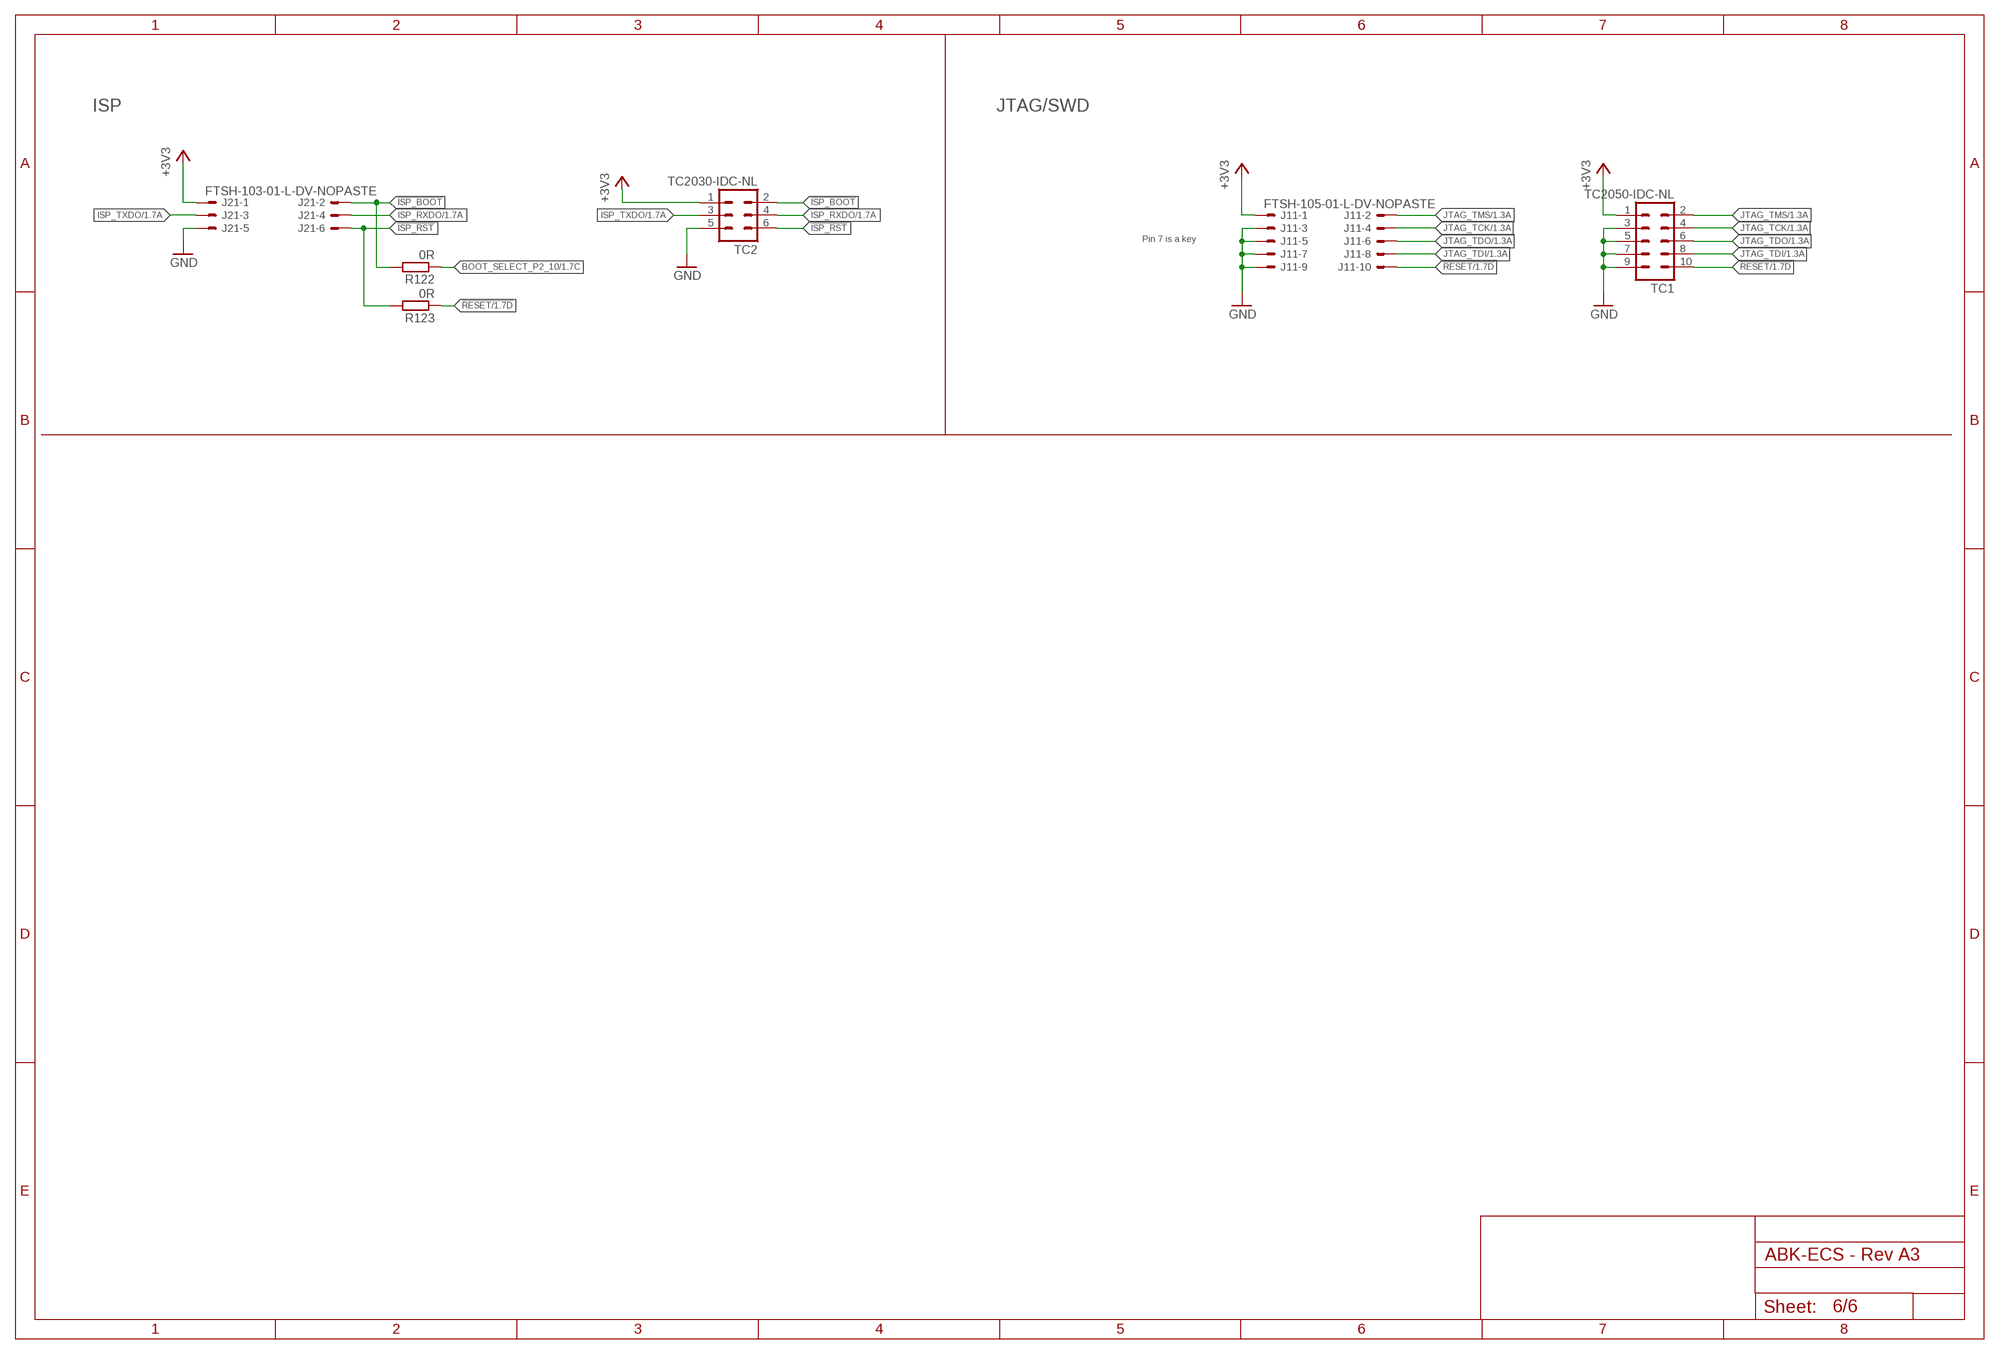
[diagram p5: schematic, sheet 6]

### Parts
J11  FTSH-105-01-L-DV-NOPASTE  [FTSH-105-01-L-DV-NOPASTE]
J21  FTSH-103-01-L-DV-NOPASTE  [FTSH-103-01-L-DV-NOPASTE]
R122  0R  R-EU_R0603  [R0603]
R123  0R  R-EU_R0603  [R0603]
TC1  TC2050-IDC-NL  [TC2050-IDC-NL]
TC2  TC2030-IDC-NL  [TC2030-IDC-NL]

### Nets
!ISP_BOOT: J21.2 R122.2 TC2.2
!ISP_RST: J21.6 R123.2 TC2.6
!RESET: J11.10 R123.1 TC1.10 ; also sheet 1
+3V3 [supply]: J11.1 J21.1 TC1.1 TC2.1 ; also sheet 1,2,3
BOOT_SELECT_P2_10 [signal]: R122.1 ; also sheet 1
GND [supply]: J11.3 J11.5 J11.7 J11.9 J21.5 TC1.3 TC1.5 TC1.7 TC1.9 TC2.5 ; also sheet 1,2,3,4,5
ISP_RXDO [signal]: J21.4 TC2.4 ; also sheet 1
ISP_TXDO [signal]: J21.3 TC2.3 ; also sheet 1
JTAG_TCK [signal]: J11.4 TC1.4 ; also sheet 1
JTAG_TDI [signal]: J11.8 TC1.8 ; also sheet 1
JTAG_TDO [signal]: J11.6 TC1.6 ; also sheet 1
JTAG_TMS [signal]: J11.2 TC1.2 ; also sheet 1

### Notes on the sheet
- ISP | JTAG/SWD
- Pin 7 is a key

## Power pins joined to a net without a drawn wire
VREFP: U2.12(VREFP)

## Library data of the parts
C1 = rcl:CPOL-EU: POLARIZED CAPACITOR, European symbol; MPN: F931A106MAA; OC_NEWARK: 58R3260
C2-C4 C6-C9 C11 C22-C24 = rcl:C-EU: CAPACITOR, European symbol; MPN: MC0603B104K160CT; OC_NEWARK: 06R4923
C5 C10 = rcl:C-EU: CAPACITOR, European symbol; MPN: GRM1885C1H180JA01D; OC_NEWARK: 14T3328
C12 C13 C16 C17 = rcl:C-EU: CAPACITOR, European symbol; MPN: GRT188R61H225KE13D; OC_NEWARK: 01AC8938
C14 C15 = rcl:C-EU: CAPACITOR, European symbol; MPN: GRM188R71H102KA01D; OC_NEWARK: 19X1713
C18 C19 = rcl:C-EU: CAPACITOR, European symbol; MF: KEMET; MPN: C0805C226M9PACTU; OC_NEWARK: 70K9142
CC1 = cc-by-sa:CC-BY-NC-SA; OC_NEWARK: unknown
D1 D2 = diode:MBRS140: Redresseur Schottky, 40 V, 1 A, Une, DO-214AA, 2 Broche(s), 600 mV; MF: ON SEMICONDUCTOR; MPN: MBRS140T3G; OC_NEWARK: 83H7272
D3 D5 = diode:STPS3L40?; MP: STMICROELECTRONICS; MPN: STPS3L40UF; OC_FARNELL: 2341599; OC_NEWARK: 06X0873
D6-D14 = diode:1N4148WS; MPN: 1N4148WS; OC_NEWARK: 31Y5518
F1 = fuse2:1812L; MPN: 3557; OC_NEWARK: 22M2711
J2 = con-multicomp:USB-B-S-RA: MULTICOMP USB-B-S-RA USB Connector, USB Type B, USB 2.0, Receptacle, 4 Positions, Through Hole Mount, Right Angle; MPN: USB-B-S-RA; OC_NEWARK: 14N8154
J4 = con-phoenix-508:MSTBA2: PHOENIX; MF: FARNELL; MPN: 1757242; OC_FARNELL: 3705171; OC_NEWARK: 71C4161
J5 J7 J8 J10 = con-molex:22-?-06: CONNECTOR wire to board 2.54 mm (.1 inch) pitch header; OC_FARNELL: unknown; OC_NEWARK: unknown
J6 J9 = con-molex:22-?-02: CONNECTOR wire to board 2.54 mm (.1 inch) pitch header; MPN: 22-05-7028; OC_FARNELL: 9731601; OC_NEWARK: 25M1728
J11 = con-samtec:FTSH-105-01-L-DV
J21 = con-samtec:FTSH-103-01-L-DV
JP1-JP4 = SparkFun:FIDUCIAL: Fiducial Alignment Points Various fiducial points for machine vision alignment.; OC_NEWARK: unknown
K1 = relay:G6K: Low Signal Relay oeiwcsnts1.omron.com/.. D20G6K0100.pdf; MPN: G6K-2G-Y 24DC; OC_FARNELL: 4484794; OC_NEWARK: 82T9378
L1 = Wurth-POWER_MAGNETICS-rev16f:WE-PD2: SMD Power Inductor Characteristics Open size Saturation currents up to 14 A Low tolerances at high inductance values Operating temperature: –40 °C to +125 °C Applications Integrated DC/DC-converter Switching regulators with low operating voltages (Graphic cards, embedded PC-Cards, Mainboards) Optimal attenuation in MHz frequency range Details see: http://katalog.we-online.de/en/pbs/WE-PD2 Updated by Dan Xu 2014-07-08 2014 (C) Wurth Elektronik; MPN: 744774115; OC_NEWARK: 08P2818
L2 = Wurth-POWER_MAGNETICS-rev16f:WE-PD2: SMD Power Inductor Characteristics Open size Saturation currents up to 14 A Low tolerances at high inductance values Operating temperature: –40 °C to +125 °C Applications Integrated DC/DC-converter Switching regulators with low operating voltages (Graphic cards, embedded PC-Cards, Mainboards) Optimal attenuation in MHz frequency range Details see: http://katalog.we-online.de/en/pbs/WE-PD2 Updated by Dan Xu 2014-07-08 2014 (C) Wurth Elektronik; MPN: 74477410; OC_NEWARK: 08P2817
LED1 LED2 LED4 LED8-LED24 = led:LED: LED OSRAM: - CHIPLED LG R971, LG N971, LY N971, LG Q971, LY Q971, LO R971, LY R971 LH N974, LH R974 LS Q976, LO Q976, LY Q976 LO Q996 - Hyper CHIPLED LW Q18S LB Q993, LB Q99A, LB R99A - SideLED LS A670, LO A670, LY A670, LG A670, LP A670 LB A673, LV A673, LT A673, LW A673 LH A674 LY A675 LS A676, LA A676, LO A676, LY A676, LW A676 LS A679, LY A679, LG A679 - Hyper Micro SIDELED® LS Y876, LA Y876, LO Y876, LY Y876 LT Y87S - SmartLED LW L88C, LW L88S LB L89C, LB L89S, LG L890 LS L89K, LO L89K, LY L89K LS L896, LA L896, LO L896, LY L896 - TOPLED LS T670, LO T670, LY T670, LG T670, LP T670 LSG T670, LSP T670, LSY T670, LOP T670, LYG T670 LG T671, LOG T671, LSG T671 LB T673, LV T673, LT T673, LW T673 LH T674 LS T676, LA T676, LO T676, LY T676, LB T676, LH T676, LSB T676, LW T676 LB T67C, LV T67C, LT T67C, LS T67K, LO T67K, LY T67K, LW E67C LS E67B, LA E67B, LO E67B, LY E67B, LB E67C, LV E67C, LT E67C LW T67C LS T679, LY T679, LG T679 LS T770, LO T770, LY T770, LG T770, LP T770 LB T773, LV T773, LT T773, LW T773 LH T774 LS E675, LA E675, LY E675, LS T675 LS T776, LA T776, LO T776, LY T776, LB T776 LHGB T686 LT T68C, LB T68C - Hyper Mini TOPLED® LB M676 - Mini TOPLED Santana® LG M470 LS M47K, LO M47K, LY M47K Source: http://www.osram.convergy.de LUXEON: - LUMILED® LXK2-PW12-R00, LXK2-PW12-S00, LXK2-PW14-U00, LXK2-PW14-V00 LXK2-PM12-R00, LXK2-PM12-S00, LXK2-PM14-U00 LXK2-PE12-Q00, LXK2-PE12-R00, LXK2-PE12-S00, LXK2-PE14-T00, LXK2-PE14-U00 LXK2-PB12-K00, LXK2-PB12-L00, LXK2-PB12-M00, LXK2-PB14-N00, LXK2-PB14-P00, LXK2-PB14-Q00 LXK2-PR12-L00, LXK2-PR12-M00, LXK2-PR14-Q00, LXK2-PR14-R00 LXK2-PD12-Q00, LXK2-PD12-R00, LXK2-PD12-S00 LXK2-PH12-R00, LXK2-PH12-S00 LXK2-PL12-P00, LXK2-PL12-Q00, LXK2-PL12-R00 Source: www.luxeon.com KINGBRIGHT: KA-3528ASYC Source: www.kingbright.com; MPN: OVS-0603; OC_NEWARK: 15R2205
LED3 LED7 = led:LED: LED OSRAM: - CHIPLED LG R971, LG N971, LY N971, LG Q971, LY Q971, LO R971, LY R971 LH N974, LH R974 LS Q976, LO Q976, LY Q976 LO Q996 - Hyper CHIPLED LW Q18S LB Q993, LB Q99A, LB R99A - SideLED LS A670, LO A670, LY A670, LG A670, LP A670 LB A673, LV A673, LT A673, LW A673 LH A674 LY A675 LS A676, LA A676, LO A676, LY A676, LW A676 LS A679, LY A679, LG A679 - Hyper Micro SIDELED® LS Y876, LA Y876, LO Y876, LY Y876 LT Y87S - SmartLED LW L88C, LW L88S LB L89C, LB L89S, LG L890 LS L89K, LO L89K, LY L89K LS L896, LA L896, LO L896, LY L896 - TOPLED LS T670, LO T670, LY T670, LG T670, LP T670 LSG T670, LSP T670, LSY T670, LOP T670, LYG T670 LG T671, LOG T671, LSG T671 LB T673, LV T673, LT T673, LW T673 LH T674 LS T676, LA T676, LO T676, LY T676, LB T676, LH T676, LSB T676, LW T676 LB T67C, LV T67C, LT T67C, LS T67K, LO T67K, LY T67K, LW E67C LS E67B, LA E67B, LO E67B, LY E67B, LB E67C, LV E67C, LT E67C LW T67C LS T679, LY T679, LG T679 LS T770, LO T770, LY T770, LG T770, LP T770 LB T773, LV T773, LT T773, LW T773 LH T774 LS E675, LA E675, LY E675, LS T675 LS T776, LA T776, LO T776, LY T776, LB T776 LHGB T686 LT T68C, LB T68C - Hyper Mini TOPLED® LB M676 - Mini TOPLED Santana® LG M470 LS M47K, LO M47K, LY M47K Source: http://www.osram.convergy.de LUXEON: - LUMILED® LXK2-PW12-R00, LXK2-PW12-S00, LXK2-PW14-U00, LXK2-PW14-V00 LXK2-PM12-R00, LXK2-PM12-S00, LXK2-PM14-U00 LXK2-PE12-Q00, LXK2-PE12-R00, LXK2-PE12-S00, LXK2-PE14-T00, LXK2-PE14-U00 LXK2-PB12-K00, LXK2-PB12-L00, LXK2-PB12-M00, LXK2-PB14-N00, LXK2-PB14-P00, LXK2-PB14-Q00 LXK2-PR12-L00, LXK2-PR12-M00, LXK2-PR14-Q00, LXK2-PR14-R00 LXK2-PD12-Q00, LXK2-PD12-R00, LXK2-PD12-S00 LXK2-PH12-R00, LXK2-PH12-S00 LXK2-PL12-P00, LXK2-PL12-Q00, LXK2-PL12-R00 Source: www.luxeon.com KINGBRIGHT: KA-3528ASYC Source: www.kingbright.com; MPN: OVS-0608; OC_NEWARK: 15R2208
LED5 LED6 = led:LED: LED OSRAM: - CHIPLED LG R971, LG N971, LY N971, LG Q971, LY Q971, LO R971, LY R971 LH N974, LH R974 LS Q976, LO Q976, LY Q976 LO Q996 - Hyper CHIPLED LW Q18S LB Q993, LB Q99A, LB R99A - SideLED LS A670, LO A670, LY A670, LG A670, LP A670 LB A673, LV A673, LT A673, LW A673 LH A674 LY A675 LS A676, LA A676, LO A676, LY A676, LW A676 LS A679, LY A679, LG A679 - Hyper Micro SIDELED® LS Y876, LA Y876, LO Y876, LY Y876 LT Y87S - SmartLED LW L88C, LW L88S LB L89C, LB L89S, LG L890 LS L89K, LO L89K, LY L89K LS L896, LA L896, LO L896, LY L896 - TOPLED LS T670, LO T670, LY T670, LG T670, LP T670 LSG T670, LSP T670, LSY T670, LOP T670, LYG T670 LG T671, LOG T671, LSG T671 LB T673, LV T673, LT T673, LW T673 LH T674 LS T676, LA T676, LO T676, LY T676, LB T676, LH T676, LSB T676, LW T676 LB T67C, LV T67C, LT T67C, LS T67K, LO T67K, LY T67K, LW E67C LS E67B, LA E67B, LO E67B, LY E67B, LB E67C, LV E67C, LT E67C LW T67C LS T679, LY T679, LG T679 LS T770, LO T770, LY T770, LG T770, LP T770 LB T773, LV T773, LT T773, LW T773 LH T774 LS E675, LA E675, LY E675, LS T675 LS T776, LA T776, LO T776, LY T776, LB T776 LHGB T686 LT T68C, LB T68C - Hyper Mini TOPLED® LB M676 - Mini TOPLED Santana® LG M470 LS M47K, LO M47K, LY M47K Source: http://www.osram.convergy.de LUXEON: - LUMILED® LXK2-PW12-R00, LXK2-PW12-S00, LXK2-PW14-U00, LXK2-PW14-V00 LXK2-PM12-R00, LXK2-PM12-S00, LXK2-PM14-U00 LXK2-PE12-Q00, LXK2-PE12-R00, LXK2-PE12-S00, LXK2-PE14-T00, LXK2-PE14-U00 LXK2-PB12-K00, LXK2-PB12-L00, LXK2-PB12-M00, LXK2-PB14-N00, LXK2-PB14-P00, LXK2-PB14-Q00 LXK2-PR12-L00, LXK2-PR12-M00, LXK2-PR14-Q00, LXK2-PR14-R00 LXK2-PD12-Q00, LXK2-PD12-R00, LXK2-PD12-S00 LXK2-PH12-R00, LXK2-PH12-S00 LXK2-PL12-P00, LXK2-PL12-Q00, LXK2-PL12-R00 Source: www.luxeon.com KINGBRIGHT: KA-3528ASYC Source: www.kingbright.com; MPN: OVS-0603; OC_FARNELL: 1716771; OC_NEWARK: 15R2205
MP1-MP4 = holes:MOUNT-PAD: MOUNTING HOLE with drill center marker; OC_NEWARK: unknown
OK1-OK4 = optocoupler:TLP283-4: TOSHIBA PHOTOCOUPLER GaAs IRED & PHOTO-TRANSISTOR Source: http://www.semicon.toshiba.co.jp/td/en/Opto/Photocoupler/en_20050928_TLP283_datasheet.pdf; MF: VISHAY/TELEFUNKEN; MPN: TCMT4100; OC_FARNELL: unknown; OC_NEWARK: 06H1639
R1-R4 R18 R19 R35-R39 R50-R53 R82-R85 R110-R113 = rcl:R-EU_: RESISTOR, European symbol; MPN: RC0603FR-074K7L; OC_NEWARK: 68R0092
R6 R7 = rcl:R-EU_: RESISTOR, European symbol; MPN: RC0603FR-0733RL; OC_NEWARK: 68R0085
R8 R9 R14 R15 R41 R54-R62 R78-R81 R106-R109 = rcl:R-EU_: RESISTOR, European symbol; MPN: RC0603FR-071K5L; OC_NEWARK: 68R0045
R10 R13 R63 R64 R66-R73 R94-R101 = rcl:R-EU_: RESISTOR, European symbol; MPN: RC0603FR-0710KL; OC_NEWARK: 68R0049
R11 R12 = rcl:R-EU_: RESISTOR, European symbol; MPN: RC0603FR-070RL; OC_NEWARK: 50Y7761
R16 R17 R22 = rcl:R-EU_: RESISTOR, European symbol; MPN: MCMR06X3162FTL; OC_FARNELL: 2073391; OC_NEWARK: 86T3613
R20 = rcl:R-EU_: RESISTOR, European symbol; MPN: MC0063W0603152K3; OC_FARNELL: 2073391; OC_NEWARK: 26M0962
R21 R23 = rcl:R-EU_: RESISTOR, European symbol; MPN: RC0603FR-0710KL; OC_FARNELL: 2073391; OC_NEWARK: 68R0049
R24 R25 = rcl:R-EU_: RESISTOR, European symbol; MPN: RC0603FR-071K5L; OC_FARNELL: 2073391; OC_NEWARK: 68R0045
R26 R40 R65 R86-R89 R114-R117 = rcl:R-EU_: RESISTOR, European symbol; MPN: RC0603FR-13100RL; OC_NEWARK: 68R0131
R27-R34 R42-R49 R74-R77 R102-R105 = rcl:R-EU_: RESISTOR, European symbol; MPN: RC0603FR-071KL; OC_NEWARK: 68R0042
R90-R93 R118-R121 = rcl:R-EU_: RESISTOR, European symbol; MPN: RC0603FR-07330RL; OC_NEWARK: 98K7391
R122 R123 = rcl:R-EU_: RESISTOR, European symbol; MPN: MCMR06X000 PTL; OC_NEWARK: 86T3500
SJ1-SJ5 = SparkFun-Passives:SOLDERJUMPER: Solder Jumper Standard SMD solder jumper. Used to automate production. Two varients : Normally Open and Normally Closed are the same, but have different paste layers. NC will have a large amount of paste and should jumper during reflow.; OC_NEWARK: unknown
SW1 SW2 = Switch_SMT:B3FS: Surface-mounting Switches Ideal for High-density Mounting; MPN: B3FS-1010; OC_NEWARK: 36M3638
T1 = exmachina:EXMACHINA-LOGO; OC_NEWARK: unknown
T2 T4-T7 T12-T15 = International_Rectifier_By_element14_Batch_1:IRLML5103TRPBF; MF: INTERNATIONAL RECTIFIER(IR); MPN: IRLML5103TRPBF; OC_NEWARK: 63J7612
T3 T8-T11 T16-T19 = transistor:MMBT2222AL: General Purpose Transistors; MF: ON SEMICONDUCTOR; MPN: MMBT2222ALT1G; OC_NEWARK: 84K8795
TC1 = TagConnect:TC2050-IDC: Tag-Connect In Circuit Programming & Debug Cable 10 Pin http://www.tag-connect.com
TC2 = TagConnect:TC2030-IDC: Tag-Connect In Circuit Programming & Debug Cable 6 Pin http://www.tag-connect.com
U1 = atmel:AT24C512C-SSHM-B: SERIAL EEPROM IC Memory Size:512Kbit,8-SOIC; MPN: AT24C512C-SSHM-B; OC_FARNELL: 1971995; OC_NEWARK: 68T4128; PACKAGE: 8SOIC; SUPPLIER: ATMEL
U2 = NXP:LPC1768FBD100; COPYRIGHT: Copyright C 2015 Accelerated Designs. All rights reserved; MANUFACTURER_PART_NUMBER: lpc1768fbd100; MPN: LPC1768FBD100; OC_NEWARK: 15R1840; VENDOR: NXP
U3 U4 = lineartechnology:LT3686HDDPBF: 37V/1.2A Step-DownRegulator in 3mm × 3mm DFN; MPN: LT3686HDD#PBF; OC_FARNELL: 2294943; OC_NEWARK: 78R8986; PACKAGE: DFN-10; SUPPLIER: Linear Technology
U6 U7 = ti:CD4050BD: CMOS Hex Buffer/Converters; MPN: CD4050BD; OC_FARNELL: 1740857; OC_NEWARK: 50R5062; PACKAGE: 16-SOIC; SUPPLIER: Texas Instruments
X1 = crystal:FC-135: 32.768kHz ±20ppm Crystal 12.5pF 70 kOhm -40°C ~ 85°C Surface Mount 2-SMD; MPN: Q13FC13500004; OC_NEWARK: 31M4970
X2 = crystal:ASE: 3.3Vdc CMOS SMD CRYSTAL CLOCK OSCILLATOR SOurce: www.abracon.com; MPN: ASE-12.000MHZ-LC-T; OC_FARNELL: unknown; OC_NEWARK: 40Y2118
X3 = keystone:3000; MF: KEYSTONE ELECTR; MPN: 3000; OC_NEWARK: 66F5622

## Net classes
0 default: width 0.178 mm
1 signal: width 0.178 mm, drill 0.35 mm
2 supply: width 0.008 mm, drill 0.5 mm